# EAGLE design ASD2021 (EAGLE 6.3)
DATABASE: ./../../../../../Components/TinyCircuits_Part_Database.txt
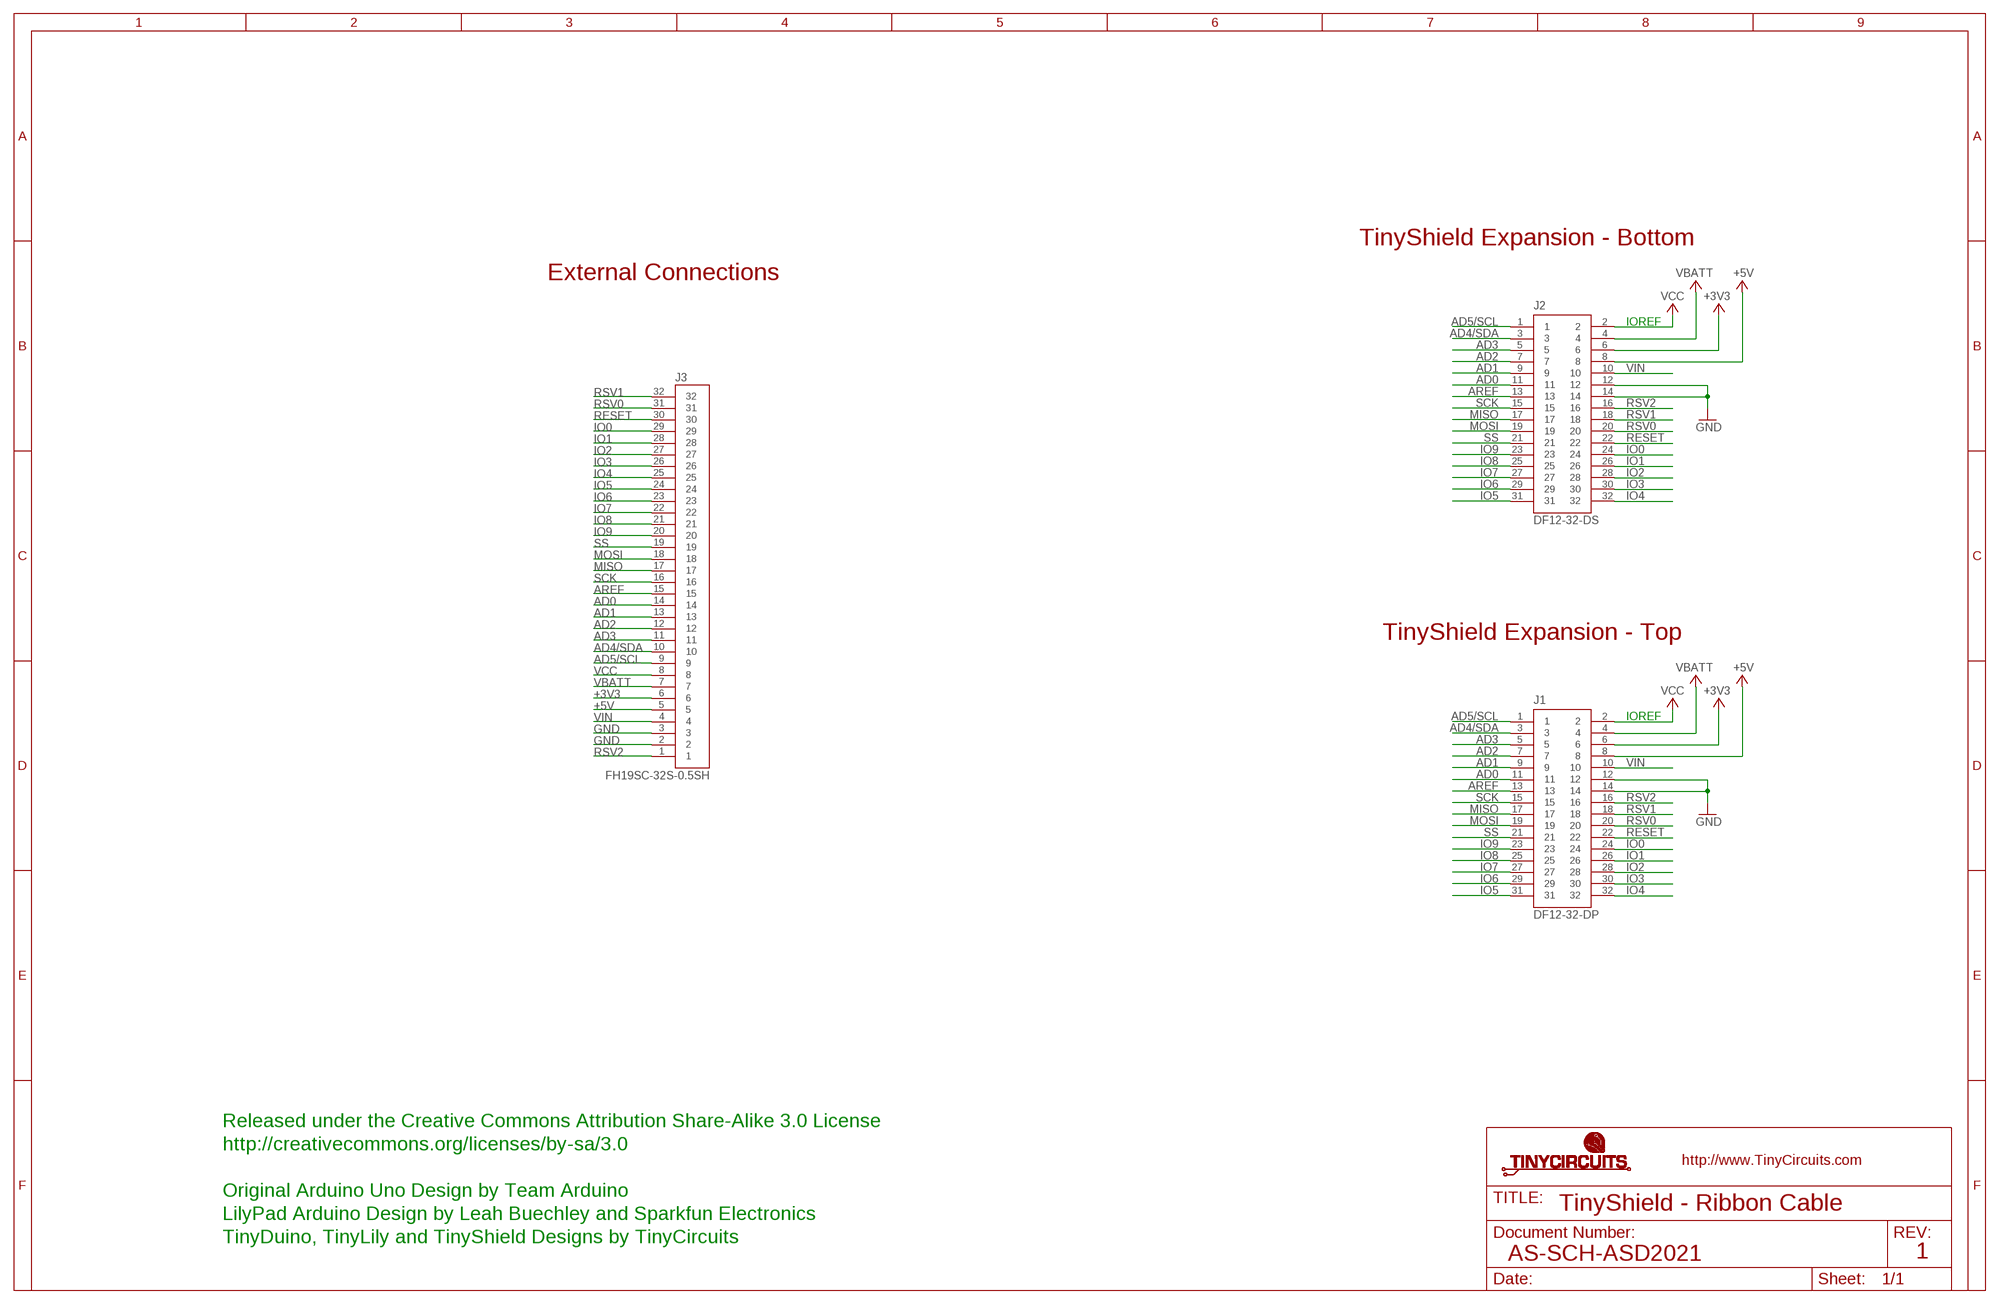
[diagram p0: schematic, sheet 1]

## Parts
J1  DF12-32-DP  AS-ITM-00015  [DF12-32-DP]
J2  DF12-32-DS  AS-ITM-00012  [DF12-32-DS]
J3  FH19SC-32S-0.5SH  AS-ITM-00234  [FH19SC-32S-0.5SH]

## Nets
+3V3: J1.6 J2.6 J3.6
+5V: J1.8 J2.8 J3.5
AD0: J1.11 J2.11 J3.14
AD1: J1.9 J2.9 J3.13
AD2: J1.7 J2.7 J3.12
AD3: J1.5 J2.5 J3.11
AD4/SDA: J1.3 J2.3 J3.10
AD5/SCL: J1.1 J2.1 J3.9
AREF: J1.13 J2.13 J3.15
GND: J1.12 J1.14 J2.12 J2.14 J3.2 J3.3
IO0: J1.24 J2.24 J3.29
IO1: J1.26 J2.26 J3.28
IO2: J1.28 J2.28 J3.27
IO3: J1.30 J2.30 J3.26
IO4: J1.32 J2.32 J3.25
IO5: J1.31 J2.31 J3.24
IO6: J1.29 J2.29 J3.23
IO7: J1.27 J2.27 J3.22
IO8: J1.25 J2.25 J3.21
IO9: J1.23 J2.23 J3.20
MISO: J1.17 J2.17 J3.17
MOSI: J1.19 J2.19 J3.18
RESET: J1.22 J2.22 J3.30
RSV0: J1.20 J2.20 J3.31
RSV1: J1.18 J2.18 J3.32
RSV2: J1.16 J2.16 J3.1
SCK: J1.15 J2.15 J3.16
SS: J1.21 J2.21 J3.19
VBATT: J1.4 J2.4 J3.7
VCC: J1.2 J2.2 J3.8
VIN: J1.10 J2.10 J3.4

## Notes on the sheet
- TinyShield Expansion - Bottom
- External Connections
- IOREF
- TinyShield Expansion - Top
- IOREF
- Released under the Creative Commons Attribution Share-Alike 3.0 License
- http://creativecommons.org/licenses/by-sa/3.0
- Original Arduino Uno Design by Team Arduino
- TinyShield - Ribbon Cable
- LilyPad Arduino Design by Leah Buechley and Sparkfun Electronics
- TinyDuino, TinyLily and TinyShield Designs by TinyCircuits
- AS-SCH-ASD2021 | 1

## Library data of the parts
J1 = tinycircuits:AS-ITM-00015: CONN HEADER 32POS 3MM SMD 0.5MM; PARTNO: AS-ITM-00015
J2 = tinycircuits:AS-ITM-00012: CONN RECEPT 32POS 3MM SMD 0.5MM; PARTNO: AS-ITM-00012
J3 = tinycircuits:AS-ITM-00234: CONN FPC/FFC 32POS .5MM SMD GOLD; PARTNO: AS-ITM-00234

## Board
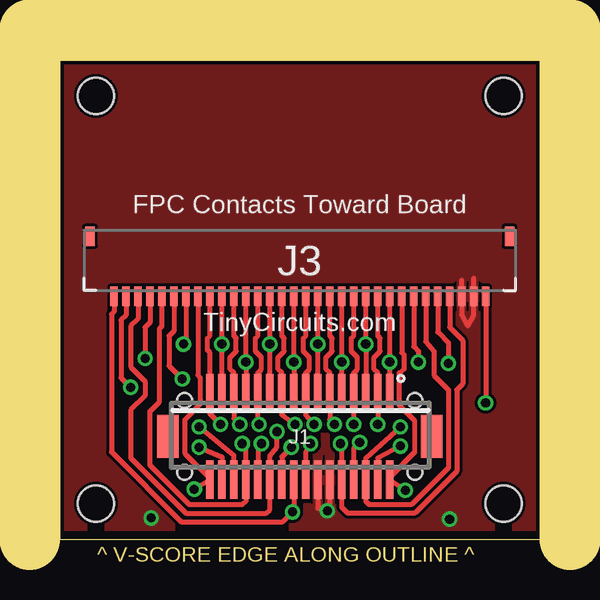
[diagram p1: board, top side]
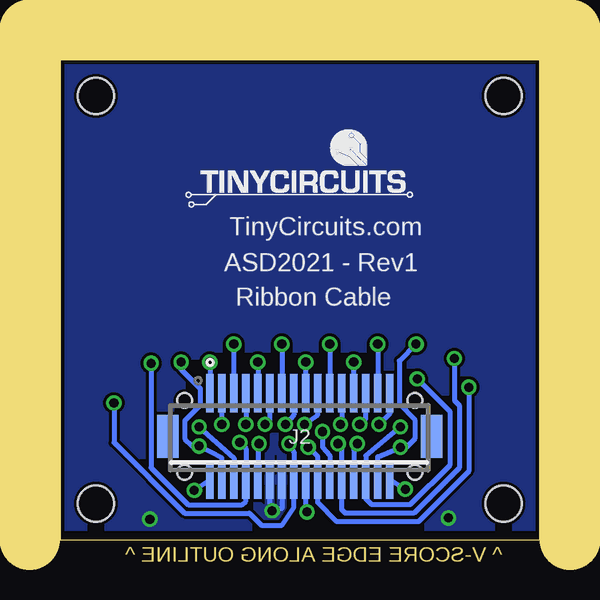
[diagram p2: board, bottom side, seen from below]

Size 20 x 20 mm. Coordinates in mm from the lower left corner, seen from the top.
Outline: 0,20 20,20 20,0 0,0 0,20
Copper layers (1*16): Top 0.035mm / dielectric 1.5mm / Bottom 0.035mm
Design rules "default *": minimum track width 5mil, minimum drill 15mil, track to track 5mil, track to pad 5mil, pad to pad 5mil, via to via 6mil, smd to smd 5mil, copper to edge 6mil, drill to drill 8mil, minimum pad ring 10mil, minimum via ring 5mil, stop-mask expansion 4mil, vias tented up to drill 25mil, thermal gap 10mil
Holes 1.5 mm at 1.5,18.5 18.5,18.5 18.5,1.5 1.5,1.5
tRestrict: 1 lines
bRestrict: 1 lines
Milling: 3 lines

### Footprints (pad centres in the part's own frame; a part is rotated, then mirrored left to right if it is on the bottom)
DF12-32-DP = smd 0.3 x 1.6: 1 -3.75,-1.8; 2 -3.75,1.8; 3 -3.25,-1.8; 4 -3.25,1.8; 5 -2.75,-1.8; 6 -2.75,1.8; 7 -2.25,-1.8; 8 -2.25,1.8; 9 -1.75,-1.8; 10 -1.75,1.8; 11 -1.25,-1.8; 12 -1.25,1.8; 13 -0.75,-1.8; 14 -0.75,1.8; 15 -0.25,-1.8; 16 -0.25,1.8; 17 0.25,-1.8; 18 0.25,1.8; 19 0.75,-1.8; 20 0.75,1.8; 21 1.25,-1.8; 22 1.25,1.8; 23 1.75,-1.8; 24 1.75,1.8; 25 2.25,-1.8; 26 2.25,1.8; 27 2.75,-1.8; 28 2.75,1.8; 29 3.25,-1.8; 30 3.25,1.8; 31 3.75,-1.8; 32 3.75,1.8 | smd 0.9 x 1.8: F1 -5.5,0; F2 5.5,0 | hole 0.6: -4.8,1.5; 4.8,1.5
DF12-32-DS = smd 0.3 x 1.6: 1 -3.75,1.8; 2 -3.75,-1.8; 3 -3.25,1.8; 4 -3.25,-1.8; 5 -2.75,1.8; 6 -2.75,-1.8; 7 -2.25,1.8; 8 -2.25,-1.8; 9 -1.75,1.8; 10 -1.75,-1.8; 11 -1.25,1.8; 12 -1.25,-1.8; 13 -0.75,1.8; 14 -0.75,-1.8; 15 -0.25,1.8; 16 -0.25,-1.8; 17 0.25,1.8; 18 0.25,-1.8; 19 0.75,1.8; 20 0.75,-1.8; 21 1.25,1.8; 22 1.25,-1.8; 23 1.75,1.8; 24 1.75,-1.8; 25 2.25,1.8; 26 2.25,-1.8; 27 2.75,1.8; 28 2.75,-1.8; 29 3.25,1.8; 30 3.25,-1.8; 31 3.75,1.8; 32 3.75,-1.8 | smd 0.9 x 1.8: F1 -5.5,0; F2 5.5,0 | hole 0.6: -4.8,1.5; 4.8,1.5
FH19SC-32S-0.5SH = smd 0.3 x 0.8: 1 -7.75,1.5; 2 -7.25,1.5; 3 -6.75,1.5; 4 -6.25,1.5; 5 -5.75,1.5; 6 -5.25,1.5; 7 -4.75,1.5; 8 -4.25,1.5; 9 -3.75,1.5; 10 -3.25,1.5; 11 -2.75,1.5; 12 -2.25,1.5; 13 -1.75,1.5; 14 -1.25,1.5; 15 -0.75,1.5; 16 -0.25,1.5; 17 0.25,1.5; 18 0.75,1.5; 19 1.25,1.5; 20 1.75,1.5; 21 2.25,1.5; 22 2.75,1.5; 23 3.25,1.5; 24 3.75,1.5; 25 4.25,1.5; 26 4.75,1.5; 27 5.25,1.5; 28 5.75,1.5; 29 6.25,1.5; 30 6.75,1.5; 31 7.25,1.5; 32 7.75,1.5 | smd 0.4 x 0.8: PAD1 -8.75,-1; PAD2 8.75,-1

### Placement (x,y rotation side)
J1  10,4.3 180 top
J2  10,4.3 0 bottom
J3  10,11.64 180 top
U$1  [DOCFIELD-TINYCIRCUITS-PCB]  33.91,-10 0 top  (outside the outline)

### Tracks (layer width: path | path; a pad name or v marks a point on that pad's centre or on a via)
+3V3  (via drill 0.38)
  Top 0.203: J3.6 15.25,8.25 15.6,7.85 15.6,6.85 16.2,6.25 16.2,3 14.65,1.45 12.9,1.45 12.75,1.6 J2.6 12.75,3.4 v14.2,4.7
  Bottom 0.203: v14.2,4.7 12.75,3.4 J2.6
+5V  (via drill 0.38)
  Top 0.203: J3.5 15.75,8.65 16.2,8.2 v16.2,7.35 | J2.8 12.25,3.8 v12.5,4.05
  Top 0.254: J2.8
  Bottom 0.203: v12.5,4.05 12.25,3.8 J2.8 12.25,1.6 12.4,1.45 14.65,1.45 16.2,3 v16.2,7.35
AD0  (via drill 0.38)
  Top 0.203: J3.14 11.25,8.5 11.35,8.4 11.35,7.85 11.1,7.6 11.1,7.1 11.25,6.95 J2.11 11.25,5 v11.45,4.8
  Bottom 0.203: v11.45,4.8 11.25,5 J2.11
AD1  (via drill 0.38)
  Top 0.203: J2.9 v11.75,7.4 J3.13
  Bottom 0.203: v11.75,7.4 J2.9
AD2  (via drill 0.38)
  Top 0.203: J3.12 12.25,8.5 12.15,8.4 12.15,7.85 12.4,7.6 12.4,7.1 12.25,6.95 J2.7 v12.25,4.8
  Bottom 0.203: J2.7 v12.25,4.8
AD3  (via drill 0.38)
  Top 0.203: J2.5 v12.75,8.15 J3.11
  Bottom 0.203: J2.5 v12.75,8.15
AD4/SDA  (via drill 0.38)
  Top 0.203: J3.10 13.25,8.5 13.35,8.4 13.35,7.85 13.1,7.6 13.1,7.1 13.25,6.95 J2.3 v13.25,4.8
  Bottom 0.203: v13.25,4.8 J2.3
AD5/SCL  (via drill 0.38)
  Top 0.203: J2.1 v13.75,7.4 J3.9
  Bottom 0.203: v13.75,7.4 J2.1
AREF  (via drill 0.38)
  Top 0.203: J2.13 v10.75,8.15 J3.15
  Bottom 0.203: v10.75,8.15 J2.13
GND  (via drill 0.38)
  Top 0.203: J2.14 10.75,1.3 v11.15,1.2 11.25,1.3 J2.12 | 16.75,10.82 J3.3 16.75,9.37 17,8.92 17.25,9.37 J3.2 17.25,10.89
  Bottom 0.203: J2.14 10.75,1.3 v11.15,1.2 11.25,1.3 J2.12
  other vias: 16.25,0.85 3.8,0.9
  pour Top: 0,20 20,20 20,0 0,0
  pour Bottom: 0,20 20,20 20,0 0,0
IO0  (via drill 0.38)
  Top 0.203: J3.29 3.75,9.05 3.55,8.85 v3.55,7.55 | v8.4,4 8.25,3.85 J2.24
  Bottom 0.203: v3.55,7.55 3.55,5.8 3.35,5.6 3.35,3 5.25,1.1 8.1,1.1 8.25,1.25 J2.24 8.25,3.85 v8.4,4
  Bottom 0.254: J2.24
IO1  (via drill 0.38)
  Top 0.203: J3.28 4.25,8.9 4.15,8.8 4.15,5.75 3.75,5.35 3.75,3.1 5.4,1.45 7.6,1.45 7.75,1.6 J2.26 7.75,3.75 v7.6,4
  Bottom 0.203: v7.6,4 7.75,3.75 J2.26
IO2  (via drill 0.38)
  Top 0.203: J2.28 7.25,3.5 v5.8,4.7 | J3.27 4.75,8.7 4.55,8.5 4.55,7.25 v5.1,6.7
  Bottom 0.203: v5.8,4.7 7.25,3.5 J2.28 7.25,1.7 7,1.45 5.4,1.45 3.75,3.1 3.75,5.35 v5.1,6.7
IO3  (via drill 0.38)
  Top 0.203: J3.26 5.25,8.25 v5.15,8.15 | v5.8,3.85 6.75,3.45 J2.30
  Bottom 0.203: v5.15,8.15 5.85,7.45 5.85,5.65 5.2,5 5.2,4.2 5.55,3.85 v5.8,3.85 6.75,3.45 J2.30
IO4  (via drill 0.38)
  Top 0.203: v5.6,2.1 J2.32 6.25,2.55 5.2,3.6 5.2,5 5.85,5.65 5.85,6.75 5.75,6.85 J3.25
  Bottom 0.203: v5.6,2.1 J2.32
IO5  (via drill 0.38)
  Top 0.203: J3.24 6.25,8.5 6.15,8.4 6.15,7.9 6.25,7.8 J2.31 6.25,5.25 v6.7,4.8
  Bottom 0.203: J2.31 6.25,5.25 v6.7,4.8
IO6  (via drill 0.38)
  Top 0.203: J2.29 v6.75,8.15 J3.23
  Top 0.254: J2.29
  Bottom 0.203: v6.75,8.15 J2.29
IO7  (via drill 0.38)
  Top 0.203: J3.22 7.25,8.5 7.35,8.4 7.35,7.85 7.1,7.6 7.1,7.1 7.25,6.95 J2.27 7.25,5.05 v7.5,4.8
  Bottom 0.203: v7.5,4.8 7.25,5.05 J2.27
IO8  (via drill 0.38)
  Top 0.203: J2.25 v7.75,7.4 J3.21
  Bottom 0.203: J2.25 v7.75,7.4
IO9  (via drill 0.38)
  Top 0.203: J3.20 8.25,8.5 8.15,8.4 8.15,7.85 8.4,7.6 8.4,7.1 8.25,6.95 J2.23 8.25,4.85 v8.3,4.8
  Bottom 0.203: J2.23 8.25,4.85 v8.3,4.8
MISO  (via drill 0.38)
  Top 0.203: J2.17 v9.75,7.4 J3.17
  Bottom 0.203: J2.17 v9.75,7.4
MOSI  (via drill 0.38)
  Top 0.203: J3.18 9.25,8.5 9.35,8.4 9.35,7.85 9.1,7.6 9.1,7.1 9.25,6.95 J2.19 9.25,5.2 v9.8,4.8
  Bottom 0.203: v9.8,4.8 9.25,5.2 J2.19
RESET  (via drill 0.38)
  Top 0.203: J3.30 3.25,9.2 2.95,8.9 2.95,7.2 3.55,6.6 3.55,6 2.95,5.4 2.95,3.4 5.25,1.1 8.6,1.1 8.75,1.25 J2.22 8.75,3.5 9.05,3.85 v9.05,4.5
  Bottom 0.203: v9.05,4.5 9.05,3.85 8.75,3.5 J2.22
RSV0  (via drill 0.38)
  Top 0.203: J3.31 2.75,9.35 2.55,9.15 2.55,6.75 v2.95,6.35 | v9.65,3.85 9.25,3.45 J2.20
  Bottom 0.203: v2.95,6.35 2.95,2.85 5.05,0.75 8.45,0.75 9.25,1.55 J2.20 9.25,3.45 v9.65,3.85
RSV1  (via drill 0.38)
  Top 0.203: J3.32 2.25,9.5 2.15,9.4 2.15,3.65 5.05,0.75 9.3,0.75 v9.7,1.15 9.75,1 J2.18
  Bottom 0.203: v9.7,1.15 9.75,1 J2.18
RSV2  (via drill 0.38)
  Top 0.203: J3.1 v17.75,5.7 | J2.16 10.25,3.65 v10.45,4
  Bottom 0.203: v17.75,5.7 17.75,4.05 14.8,1.1 12.1,1.1 11.6,0.6 10.75,0.6 10.25,1.35 J2.16 10.25,3.65 v10.45,4
SCK  (via drill 0.38)
  Top 0.203: J3.16 10.25,8.5 10.15,8.4 10.15,7.85 10.4,7.6 10.4,7.1 10.25,6.95 J2.15 10.25,5.2 v10.6,4.8
  Bottom 0.203: J2.15 10.25,5.2 v10.6,4.8
SS  (via drill 0.38)
  Top 0.203: J2.21 v8.75,8.15 J3.19
  Bottom 0.203: v8.75,8.15 J2.21
VBATT  (via drill 0.38)
  Top 0.203: v14.2,3.9 13.25,3.4 J2.4 | J3.7 14.75,8.05 14.95,7.85 v14.95,7.4
  Bottom 0.203: J2.4 13.25,3.4 v14.2,3.9 14.5,3.9 14.8,4.2 14.8,4.95 14.15,5.6 14.15,6.3 14.95,7.1 v14.95,7.4
VCC  (via drill 0.38)
  Top 0.203: v14.4,2.05 J2.2 13.75,2.6 | J3.8 14.25,7.8 14.35,7.7 14.35,7.1 14.15,6.95 14.15,5.6 14.8,4.95 14.8,3.65 13.75,2.6 | 13.75,2.9 13.75,2.6
  Bottom 0.203: v14.4,2.05 J2.2
VIN  (via drill 0.38)
  Top 0.203: J3.4 16.25,8.85 16.8,8.3 16.8,6.5 16.55,6.25 16.55,2.85 14.8,1.1 12,1.1 11.75,1.35 J2.10 11.75,3.9 v11.7,4
  Bottom 0.203: v11.7,4 11.75,3.9 J2.10

### Text on the board
Dimension: ^ V-SCORE EDGE ALONG OUTLINE ^
tPlace: FPC Contacts Toward Board | TinyCircuits.com
bPlace: TinyCircuits.com | ASD2021 - Rev1 | Ribbon Cable
Document: FABRICATION DRAWING | NOTES: | 1. PRINTED CIRCUIT BOARD MADE FROM NEMA GRADE FR-4 EPOXY LAMINATE | WITH 1 OUNCE COPPER PLATING AND .024 THICKNESS. | 2. ALL DIMENSIONS ARE GIVEN IN INCHES. | 3. CIRCUIT PATHS ARE FOR REFERENCE ONLY. | 4. HOLE SIZES SHOWN ARE FINISHED DIAMETERS AFTER PLATING. | 5. BOARD PLATED USING REFLOW OR SIMILAR METHOD. | 6. BOARD TO HAVE BLUE SOLDER MASK ON PLATED SURFACES USING WET FILM | 7. SILKSCREEN BOARD USING WHITE INK. | SR100 OR SR1010 EPOXY. EQUIVALENT WET OR DRY FILM MAY BE USED. | 8. THE FOLLOWING INFORMATION APPLIES TO THIS BOARD: | * 2 COPPER LAYERS | * .024 BOARD THICKNESS | * REQUIRES TOP SIDE SILKSCREEN | Released under the Creative Commons Attribution Share-Alike 3.0 License | http://creativecommons.org/licenses/by-sa/3.0 | Original Arduino Uno Design by Team Arduino | LilyPad Arduino Design by Leah Buechley and Sparkfun Electronics | TinyDuino, TinyLily and TinyShield Designs by TinyCircuits | TinyShield - Ribbon Cable | AS-PCB-ASD2021 | 1